# EAGLE design Dual_filter_common_mode_and_differential (EAGLE 7.7.0)
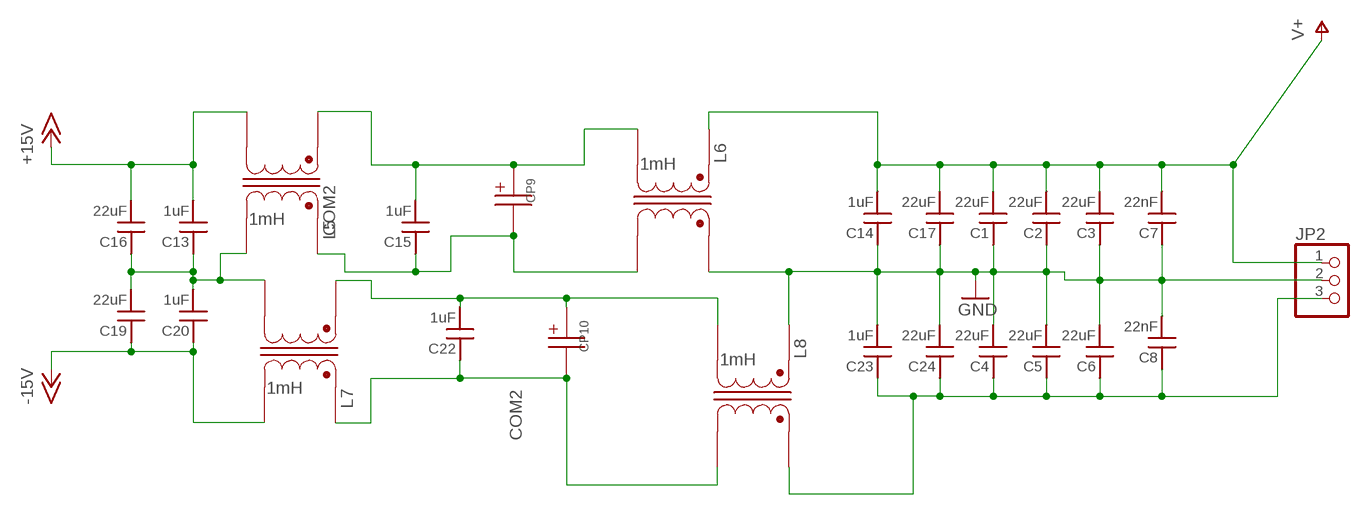
[diagram p0: schematic, sheet 1]

## Parts
C1  22uF  C_MLCC_SMDCMLCC_0805  [C_MLCC_0805]
C2  22uF  C_MLCC_SMDCMLCC_0805  [C_MLCC_0805]
C3  22uF  C_MLCC_SMDCMLCC_0805  [C_MLCC_0805]
C4  22uF  C_MLCC_SMDCMLCC_0805  [C_MLCC_0805]
C5  22uF  C_MLCC_SMDCMLCC_0805  [C_MLCC_0805]
C6  22uF  C_MLCC_SMDCMLCC_0805  [C_MLCC_0805]
C7  22nF  C_MLCC_SMDCMLCC_0306  [C_MLCC_0306]
C8  22nF  C_MLCC_SMDCMLCC_0306  [C_MLCC_0306]
C13  1uF  C_MLCC_SMDCMLCC_0805  [C_MLCC_0805]
C14  1uF  C_MLCC_SMDCMLCC_0805  [C_MLCC_0805]
C15  1uF  C_MLCC_SMDCMLCC_0805  [C_MLCC_0805]
C16  22uF  C_MLCC_SMDCMLCC_0805  [C_MLCC_0805]
C17  22uF  C_MLCC_SMDCMLCC_0805  [C_MLCC_0805]
C19  22uF  C_MLCC_SMDCMLCC_0805  [C_MLCC_0805]
C20  1uF  C_MLCC_SMDCMLCC_0805  [C_MLCC_0805]
C22  1uF  C_MLCC_SMDCMLCC_0805  [C_MLCC_0805]
C23  1uF  C_MLCC_SMDCMLCC_0805  [C_MLCC_0805]
C24  22uF  C_MLCC_SMDCMLCC_0805  [C_MLCC_0805]
CP9  CAP-POLPANASONIC_F  [PANASONIC_F]
CP10  CAP-POLPANASONIC_F  [PANASONIC_F]
JP2  PINHD-1X3  [1X03]
L5  1mH  COILCRAFT_MSD1260  [COILCRAFT_TRANSFORMER_MSD1260]
L6  1mH  COILCRAFT_MSD1260  [COILCRAFT_TRANSFORMER_MSD1260]
L7  1mH  COILCRAFT_MSD1260  [COILCRAFT_TRANSFORMER_MSD1260]
L8  1mH  COILCRAFT_MSD1260  [COILCRAFT_TRANSFORMER_MSD1260]

## Nets
+15V2: C13.P$2 C16.P$2 L5.P$4 ; supply symbol labelled +15V
-15V2: C19.P$1 C20.P$1 L7.P$3 ; supply symbol labelled -15V
COM2: C13.P$1 C16.P$1 C19.P$2 C20.P$2 L5.P$3 L7.P$4
GND2: C1.P$1 C2.P$1 C3.P$1 C4.P$2 C5.P$2 C6.P$2 C7.P$1 C8.P$2 C14.P$1 C17.P$1 C23.P$2 C24.P$2 JP2.2 L6.P$2 L8.P$1 ; supply symbol labelled GND
N$6: C15.P$2 CP9.+ L5.P$2 L6.P$3
N$7: C15.P$1 CP9.- L5.P$1 L6.P$4
N$9: C22.P$2 CP10.+ L7.P$2 L8.P$3
N$10: C22.P$1 CP10.- L7.P$1 L8.P$4
N$13: C4.P$1 C5.P$1 C6.P$1 C8.P$1 C23.P$1 C24.P$1 JP2.3 L8.P$2
V+2: C1.P$2 C2.P$2 C3.P$2 C7.P$2 C14.P$2 C17.P$2 JP2.1 L6.P$1 ; supply symbol labelled V+

## Library data of the parts
C1-C6 C16 C17 C19 C24 = jqi_passives:C_MLCC_SMD; DIGIKEY: 445-9112-1-ND
C7 C8 = jqi_passives:C_MLCC_SMD; DIGIKEY: 490-4317-1-ND
C13-C15 C20 C22 C23 = jqi_passives:C_MLCC_SMD; DIGIKEY: 587-5018-1-ND
CP9 CP10 = rlc-jqi:CAP-POL: Polarized SMT Capacitor
JP2 = pinhead:PINHD-1X3: PIN HEADER; DIGIKEY: WM4201-ND
L5-L8 = Poe:COILCRAFT_MSD1260; COILCRAFT: MSD7342-824MLB

## Board
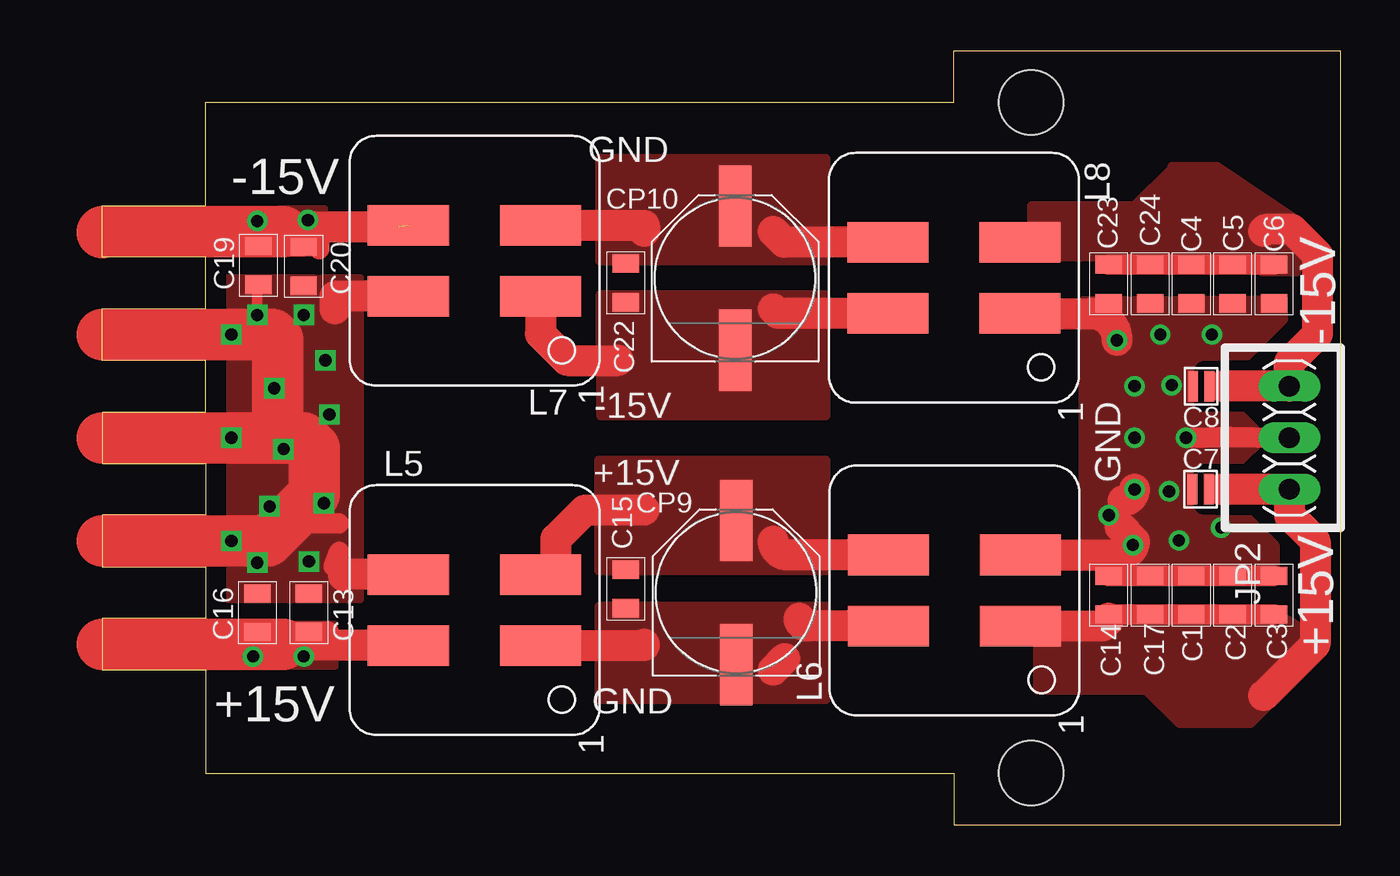
[diagram p1: board, top side]
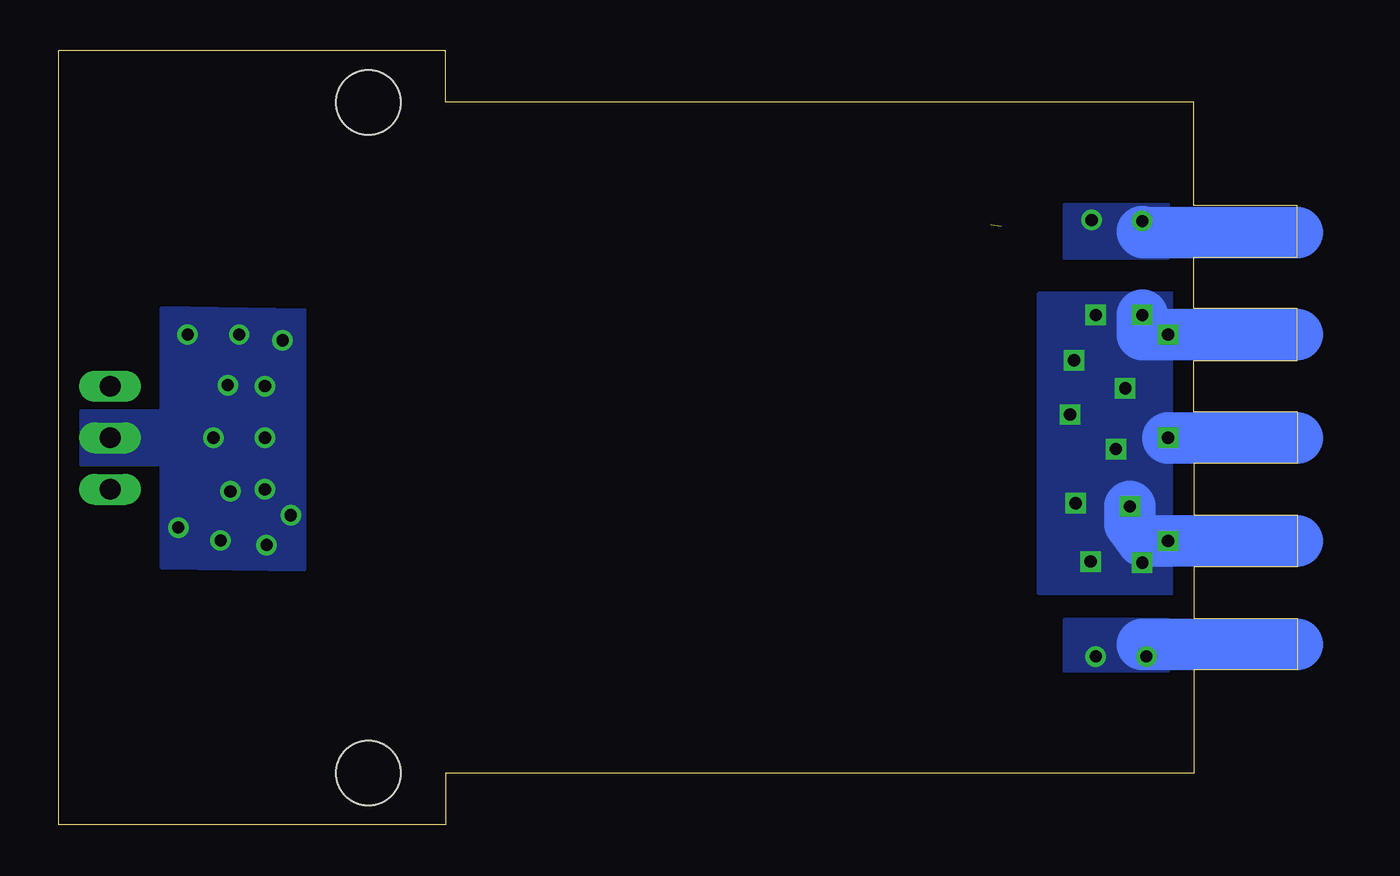
[diagram p2: board, bottom side, seen from below]

Size 60.96 x 38.1 mm. Coordinates in mm from the lower left corner, seen from the top.
Outline: 0,20.32 0,17.78 5.08,17.78 5.08,15.24 0,15.24 0,12.7 5.08,12.7 5.08,10.16 0,10.16 0,7.62 5.08,7.62 5.08,2.54 41.91,2.54 41.91,0 60.96,0 60.96,38.1 41.91,38.1 41.91,35.56 5.08,35.56 5.08,30.48 0,30.48 0,27.94 5.08,27.94 5.08,25.4 0,25.4 0,22.86 5.08,22.86 5.08,20.32 0,20.32
Copper layers (1*16): Top 0.035mm / dielectric 1.5mm / Bottom 0.035mm
Design rules "default *": minimum track width 10mil, minimum drill 0.6mm, track to track 8mil, track to pad 8mil, pad to pad 8mil, via to via 8mil, smd to smd 8mil, copper to edge 40mil, drill to drill 8mil, minimum pad ring 10mil, minimum via ring 8mil, stop-mask expansion 4mil, vias tented up to drill 0mil, thermal gap 10mil
Holes 3.17 mm at 45.72,35.56 45.72,2.54

### Footprints (pad centres in the part's own frame; a part is rotated, then mirrored left to right if it is on the bottom)
C_MLCC_0805 = smd 0.9 x 1.3: P$1 -0.95,0; P$2 0.95,0
C_MLCC_0306 = smd 0.5 x 1.5: P$1 -0.4,0; P$2 0.4,0
PANASONIC_F = smd 4 x 1.6: + 3.55,0; - -3.55,0
1X03 = drill 1.016 long: 1 -2.54,0; 2 0,0; 3 2.54,0
COILCRAFT_TRANSFORMER_MSD1260 = smd 2 x 4: P$1 1.75,3.25; P$2 -1.75,3.25; P$3 -1.75,-3.25; P$4 1.75,-3.25

### Placement (x,y rotation side)
C1  53.59,11.3 270 top
C2  55.63,11.3 270 top
C3  57.66,11.3 270 top
C4  53.59,26.62 270 top
C5  55.63,26.62 270 top
C6  57.66,26.62 270 top
C7  54.05,16.51 0 top
C8  54.08,21.59 180 top
C13  10.16,10.44 270 top
C14  49.53,11.3 270 top
C15  25.76,11.61 90 top
C16  7.62,10.44 270 top
C17  51.56,11.3 270 top
C19  7.67,27.53 270 top
C20  9.91,27.48 270 top
C22  25.76,26.67 90 top
C23  49.53,26.62 270 top
C24  51.56,26.62 270 top
CP9  31.19,11.43 90 top
CP10  31.14,26.9 90 top
JP2  58.42,19.05 90 top
L5  18.31,10.57 270 top
L6  41.94,11.53 270 top
L7  18.31,27.76 270 top
L8  41.91,26.92 270 top

### Tracks (layer width: path | path; a pad name or v marks a point on that pad's centre or on a via)
15V2
  pour Top (no thermals): 6.2,8.13 9.8,8.13 11.02,9.35 6.96,9.35 6.65,9.04
+15V2  (via drill 0.6)
  Top 0.406: 4.81,8.93 3.81,8.93 6.35,8.89 | 9.35,9.5 8.89,9.5 8.89,9.44
  Top 0.508: C13.P$2 8.76,9.08 8.76,8.93 | C16.P$2 9.02,9.08 9.02,8.93 | 8.89,8.89 9.4,8.89
  Top 1.016: 9.02,8.93 8.76,8.93 6.73,8.89 4.81,8.93 3.05,8.93 3.05,8.89 | 8.89,9.44 7.62,8.89 7.42,8.89 v7.42,8.28 | 11.12,9.5 9.35,9.5 9.35,8.39
  Top 1.524: L5.P$4 9.4,8.82 9.4,8.89
  Top 2.54: 6.35,8.89 0,8.89 | 6.73,8.89 7.62,8.89 8.89,8.89
  Bottom 2.54: 7.62,8.89 0,8.89
  other vias: 9.91,8.28
  pour Bottom (no thermals): 6.35,10.06 11.43,10.06 11.43,7.62 6.35,7.62
  pour Top (no thermals): 11.51,7.77 11.48,9.91 9.17,9.91 8.71,9.63 8.71,9.32 9.35,7.75
-15V2  (via drill 0.6)  (1 unrouted)
  Top 0.254: 9.96,28.6 9.91,28.6 C20.P$1
  Top 0.508: 8.8,28.69 arc-90 7.62,29.21 | 8.89,29.21 9.96,28.6 | 10.67,28.35 C20.P$1
  Top 1.016: C19.P$1 7.62,28.48 7.62,29.21 | 10.67,28.35 10.67,28.96 arc90 10.19,29.44
  Top 1.524: 10.19,29.44 14.55,29.44
  Top 2.54: 0,29.16 arc-90 0.05,29.21 7.62,29.21 8.89,29.21
  Bottom 0.254: v7.62,29.72 7.62,29.21
  Bottom 2.54: 7.62,29.21 7.57,29.16 0,29.16
  other vias: 10.11,29.77
  pour Top (no thermals): 10.97,28.12 11,30.35 8.69,30.35 8.23,30.07 8.23,29.77 8.94,28.07
  pour Bottom (no thermals): 6.35,27.94 6.35,30.48 11.43,30.48 11.43,27.94
COM2  (via drill 0.6)
  Top 0.508: v7.62,25.09 7.62,26.53
  Top 1.016: 11.38,12.72 11.64,13.42 | 11.63,14.83 10,14.83
  Top 1.524: 7.11,24.13 6.6,24.13 | L5.P$3 11.86,12.32 11.86,12.27 | L7.P$4 11.43,26.01 11.43,25.4
  Top 2.54: 0,24.13 6.6,24.13 8.38,24.13 8.64,23.88 8.64,19.81 7.87,19.05 v6.35,19.05 | v6.35,19.05 0,19.05 | v6.35,19.05 9.91,19.05 10.41,18.54 10.41,16.26 8.13,13.97 0,13.97
  Bottom 2.54: v7.62,25.09 7.62,24.13 0,24.13 | v6.35,19.05 0,19.05 | v8.23,15.67 8.23,14.81 7.62,13.97 0,13.97
  other vias: 9.91,25.1 10.97,22.86 11.18,20.19 10.16,12.95 7.62,12.9 8.92,18.49 8.46,21.49 10.9,15.82 6.35,24.13 6.35,13.97
  pour Top (isolate 0.762, no thermals): 0.03,26.97 12.73,26.97 12.73,11.02 0.03,11.02
  pour Bottom (isolate 0.762, no thermals): 0,26.11 12.7,26.11 12.7,11.43 0,11.43
GND2  (via drill 0.6)
  Top 0.254: 49.53,25.87 49.53,25.4
  Top 1.016: C14.P$1 C17.P$1 C1.P$1 C2.P$1 C3.P$1 | JP2.2 58.22,18.85 58.01,19.05 55.5,19.07 v53.34,19.05
  Top 1.524: 50.24,15.95 arc90 v50.8,16.51 | 50.09,14.68 50.8,13.97 arc-90 50.11,13.28 L6.P$2 | L8.P$1 48.61,25.17 arc-90 v49.94,23.85
  other vias: 52.07,24.13 54.61,24.13 55.07,14.63 50.72,13.77 49.53,15.24 50.8,19.05 52.5,16.41 52.63,21.64 50.8,21.59 52.98,14
  pour Top (isolate 0.508, no thermals): 48.46,25.81 58.17,25.86 58.14,25.58 58.14,24.87 55.83,22.56 55.88,20.32 57.15,19.05 55.88,17.78 55.8,15.67 57.73,13.74 57.73,12.42 55.96,12.5 48.26,12.7 48.26,25.81
  pour Bottom (no thermals): 48.87,25.3 55.88,25.4 55.88,20.32 60.96,20.32 60.96,17.78 55.88,17.78 55.88,12.7 48.87,12.6
N$6
  Top 1.016: CP9.+ 31.17,15.9
  Top 1.524: L5.P$2 22.33,12.42 22.33,14.07 23.75,15.49 26.64,15.49 26.67,15.52 | L6.P$3 33.71,13.28 arc-90 33.02,13.97
  pour Top (no thermals): 24.41,12.5 24.41,17.96 35.61,17.96 35.61,12.5
N$7
  Top 1.016: CP9.- 31.14,8.79
  Top 1.524: L5.P$1 26.67,8.82 26.67,8.89 | 33.58,8.18 33.02,7.62 | L6.P$4 34.67,9.78 arc-90 34.29,10.16
  pour Top (no thermals): 24.43,6.15 24.43,10.77 35.61,10.77 35.61,6.15
N$9
  Top 1.524: L7.P$2 26.67,29.51 26.67,29.21 | L8.P$3 33.56,28.67 33.02,29.21
  pour Top (no thermals): 24.46,27.74 24.46,32.82 35.61,32.82 35.61,27.74
N$10
  Top 1.524: L7.P$1 21.56,24.16 22.86,22.86 25.4,22.86 | L8.P$4 33.25,25.17 33.02,25.4
  pour Top (no thermals): 24.51,20.12 24.49,26.09 35.59,26.09 35.61,20.12
N$13
  Top 0.254: 55.09,21.59 55.85,21.57 C8.P$1
  Top 1.016: C23.P$1 C24.P$1 C4.P$1 C5.P$1 C6.P$1
  Top 1.524: 57.15,29.21 57.25,29.31 58.55,29.31 59.82,28.04 59.82,24.16 58.42,22.76 JP2.3 55.09,21.59
  pour Top (no thermals): 59.03,27.99 59,29.64 54.86,32.41 52.63,32.41 52.63,32.31 50.8,30.48 45.72,30.48 45.72,27.94 55.88,27.94 57.1,27.2 58.75,27.18
V+2
  Top 0.254: C7.P$2 54.99,16.51
  Top 1.016: C14.P$2 C17.P$2 C1.P$2 C2.P$2 C3.P$2
  Top 1.524: 49.53,10.16 arc-90 49.37,10 arc-90 49.15,9.78 L6.P$1 | 57.15,6.35 59.69,8.89 59.69,13.97 58.42,15.24 JP2.1 54.99,16.51
  pour Top (no thermals): 59.49,9.42 60.22,8.71 56.49,4.98 53.04,4.98 51.36,6.6 46.02,6.6 46.02,10.21 55.17,10.31 57.38,10.64

### Text on the board
tPlace: GND | -15V | -15V | -15V | GND | +15V | +15V | GND | +15V